# Altium schematic sheet STRWHL-S04-V00-PSU-LEDs.SchDoc: Power Supply (9-25V to 3v3 @ 0.1-0.3A) NEOPIXEL SUPPLY
size A3; DrawnBy: Jonn Dillon; DocumentNumber: 9; Revision: 00; SheetNumber: 9; SheetTotal: 9; Project: Steering Wheel 2020; PageSetup: Record=PageOptions|CenterHorizontal=True|CenterVertical=True|PrintScale=0.97|XCorrection=1.00|YCorrection=1.00|PrintKind=0|BorderSize=5000000|LeftOffset=0|BottomOffset=0|Orientation=2|PaperLength=1000|PaperWidth=1000|Scale=100|PaperSource=7|PrintQuality=-4|MediaType=1|DitherType=10|PaperKind=A4|PrintScaleMode=1
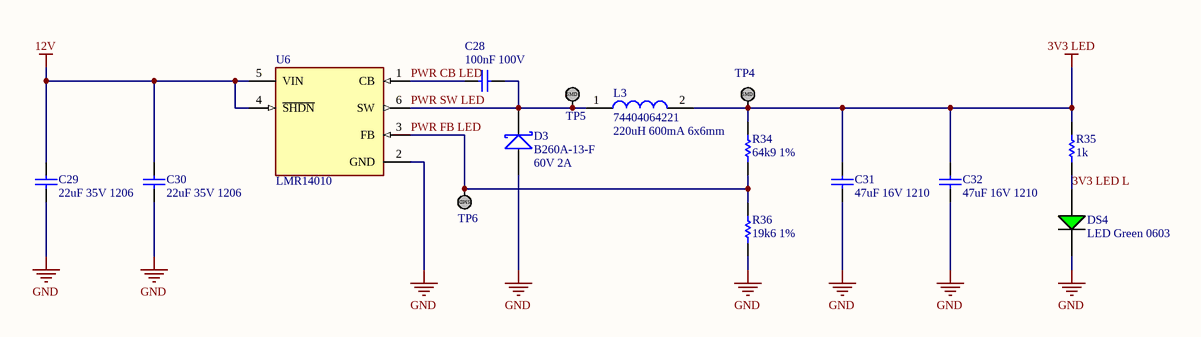
[diagram p0: STRWHL-S04-V00-PSU-LEDs.SchDoc]

## Parts
C28  100nF 100V  [Cap_Ceramic_0603]
C29  22uF 35V 1206  [Cap_Ceramic_1206]
C30  22uF 35V 1206  [Cap_Ceramic_1206]
C31  47uF 16V 1210  [Cap_Ceramic_1210]
C32  47uF 16V 1210  [Cap_Ceramic_1210]
D3  B260A-13-F  [SMA]
DS4  LED Green 0603  [LED GREEN 0603]
L3  74404064221  [Inductor_6x6mm]
R34  64k9 1%  [Res_ThinFilm_0603]
R35  1k  [Res_ThinFilm_0603]
R36  19k6 1%  [Res_ThinFilm_0603]
TP4  TestPoint_SMD  [TestPointSMD]  (value not drawn)
TP5  TestPoint_SMD  [TestPointSMD]  (value not drawn)
TP6  TestPoint_SMD  [TestPointSMD]  (value not drawn)
U6  LMR14010  [LMR14010]

## Nets
3V3 LED: C31.2 C32.2 L3.2 R34.2 R35.2 TP4.1
12V: C29.2 C30.2 U6.4(~{SHDN}) U6.5(VIN)
GND: C29.1 C30.1 C31.1 C32.1 D3.A DS4.2(C) R36.1 U6.2(GND)
3V3 LED L: DS4.1(A) R35.1
PWR CB LED: C28.1 U6.1(CB)
PWR FB LED: R34.1 R36.2 TP6.1 U6.3(FB)
PWR SW LED: C28.2 D3.K L3.1 TP5.1 U6.6(SW)

## Notes on the sheet
- (near L3) 220uH 600mA 6x6mm
- (near D3) 60V 2A
- Revision History:
- Sheet Title:
- Rev
- Date
- Description
- Project:
- Size:
- Drawn By:
- A3
- Number:
- Revision:
- Sheet
- Version:
- of
- QUT Motorsport
- O-120, Gardens Point
- 2 George Street
- Brisbane, QLD 4000
- Australia
- Print Date:
- Print Time:
- File Name:
- (in symbol TestPoint_SMD) SMD

## Library data of the parts
C28 = 100nF 100V 5% X7R 0603: Capacitor, Ceramic, SMD, 100nF, 100V, 5%, X7R, 0603
C29 C30 = 22uF 35V 10% X7R 1206: Capacitor, Ceramic, SMD, 22uF, 35V, 10%, X7R, 1206
C31 C32 = 47uF 16V 10% X7R 1210: Capacitor, Ceramic, SMD, 47uF, 16V, 5%, X7R, 1210
D3 = B260A-13-F: Diode, Schottky Barrier Rectifier, 60 V, 2 A, B260A-13-F
L3 = 74404064221: FIXED IND 220UH 660MA 850 MOHM; ComponentLink1Description: Digikey; ComponentLink1URL: https://www.digikey.com.au/product-detail/en/w%C3%BCrth-elektronik/74404064221/732-7261-1-ND/5353241; ComponentLink2Description: LCSC A; ComponentLink2URL: https://lcsc.com/product-detail/Power-Inductors_Sunlord-SWPA6045S221MT_C91047.html; ComponentLink3Description: LCSC B; ComponentLink3URL: https://lcsc.com/product-detail/Power-Inductors_SXN-Shun-Xiang-Nuo-Elec-SMNR6045-221MT_C467145.html
R34 = 64k9 1% 0603: Resistor, SMD, 64k9, 0.1W, 5%, 0603
R35 = 1k 5% 0603: Resistor, SMD, 1k, 0.1W, 5%, 0603
R36 = 19k6 1% 0603: Resistor, SMD, 19k6, 0.1W, 5%, 0603